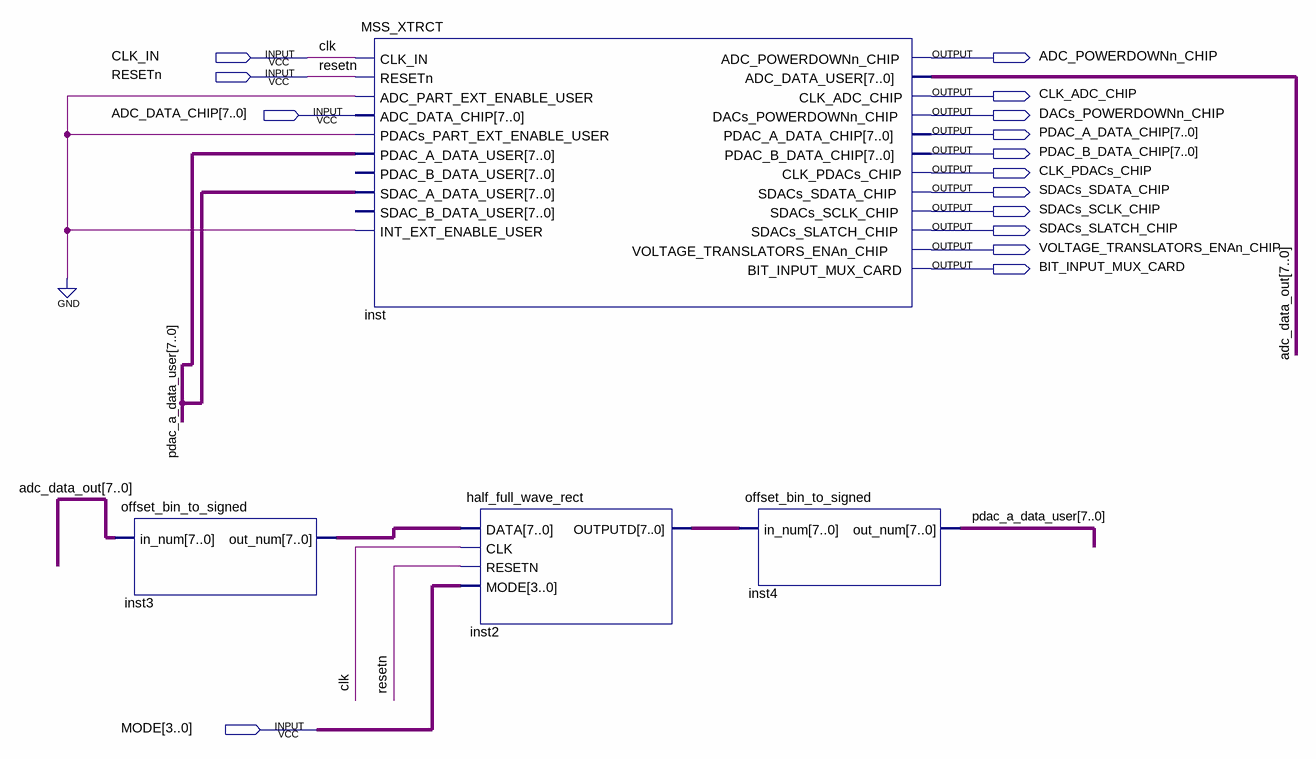
[diagram p0: schematic sheet]
// Quartus schematic MSS_BASIC.bdf as structural Verilog: 4 symbols, 15 pins
module MSS_BASIC (
  input  CLK_IN,
  input  RESETn,
  input  [7:0] ADC_DATA_CHIP,
  input  [3:0] MODE,
  output ADC_POWERDOWNn_CHIP,
  output CLK_ADC_CHIP,
  output DACs_POWERDOWNn_CHIP,
  output [7:0] PDAC_A_DATA_CHIP,
  output [7:0] PDAC_B_DATA_CHIP,
  output CLK_PDACs_CHIP,
  output SDACs_SDATA_CHIP,
  output SDACs_SCLK_CHIP,
  output SDACs_SLATCH_CHIP,
  output VOLTAGE_TRANSLATORS_ENAn_CHIP,
  output BIT_INPUT_MUX_CARD
);

  wire [7:0] adc_data_out, inst2_outputd, inst3_out_num, pdac_a_data_user;

  offset_bin_to_signed inst3 (.in_num(adc_data_out), .out_num(inst3_out_num));
  MSS_XTRCT inst (
    .CLK_IN(CLK_IN), .RESETn(RESETn), .ADC_PART_EXT_ENABLE_USER(1'b0), .ADC_DATA_CHIP(ADC_DATA_CHIP),
    .PDACs_PART_EXT_ENABLE_USER(1'b0), .PDAC_A_DATA_USER(pdac_a_data_user),
    .SDAC_A_DATA_USER(pdac_a_data_user), .INT_EXT_ENABLE_USER(1'b0),
    .ADC_POWERDOWNn_CHIP(ADC_POWERDOWNn_CHIP), .ADC_DATA_USER(adc_data_out), .CLK_ADC_CHIP(CLK_ADC_CHIP),
    .DACs_POWERDOWNn_CHIP(DACs_POWERDOWNn_CHIP), .PDAC_A_DATA_CHIP(PDAC_A_DATA_CHIP),
    .PDAC_B_DATA_CHIP(PDAC_B_DATA_CHIP), .CLK_PDACs_CHIP(CLK_PDACs_CHIP),
    .SDACs_SDATA_CHIP(SDACs_SDATA_CHIP), .SDACs_SCLK_CHIP(SDACs_SCLK_CHIP),
    .SDACs_SLATCH_CHIP(SDACs_SLATCH_CHIP), .VOLTAGE_TRANSLATORS_ENAn_CHIP(VOLTAGE_TRANSLATORS_ENAn_CHIP),
    .BIT_INPUT_MUX_CARD(BIT_INPUT_MUX_CARD));  // open: PDAC_B_DATA_USER, SDAC_B_DATA_USER
  half_full_wave_rect inst2 (.DATA(inst3_out_num), .CLK(CLK_IN), .RESETN(RESETn), .MODE(MODE), .OUTPUTD(inst2_outputd));
  offset_bin_to_signed inst4 (.in_num(inst2_outputd), .out_num(pdac_a_data_user));

  // Other names for the same wires on the sheet: clk = CLK_IN
endmodule
